# EasyEDA Pro project b6s.eprj, schematic Schematic1
Board Name: Board1; Create Date: 2024-09-07
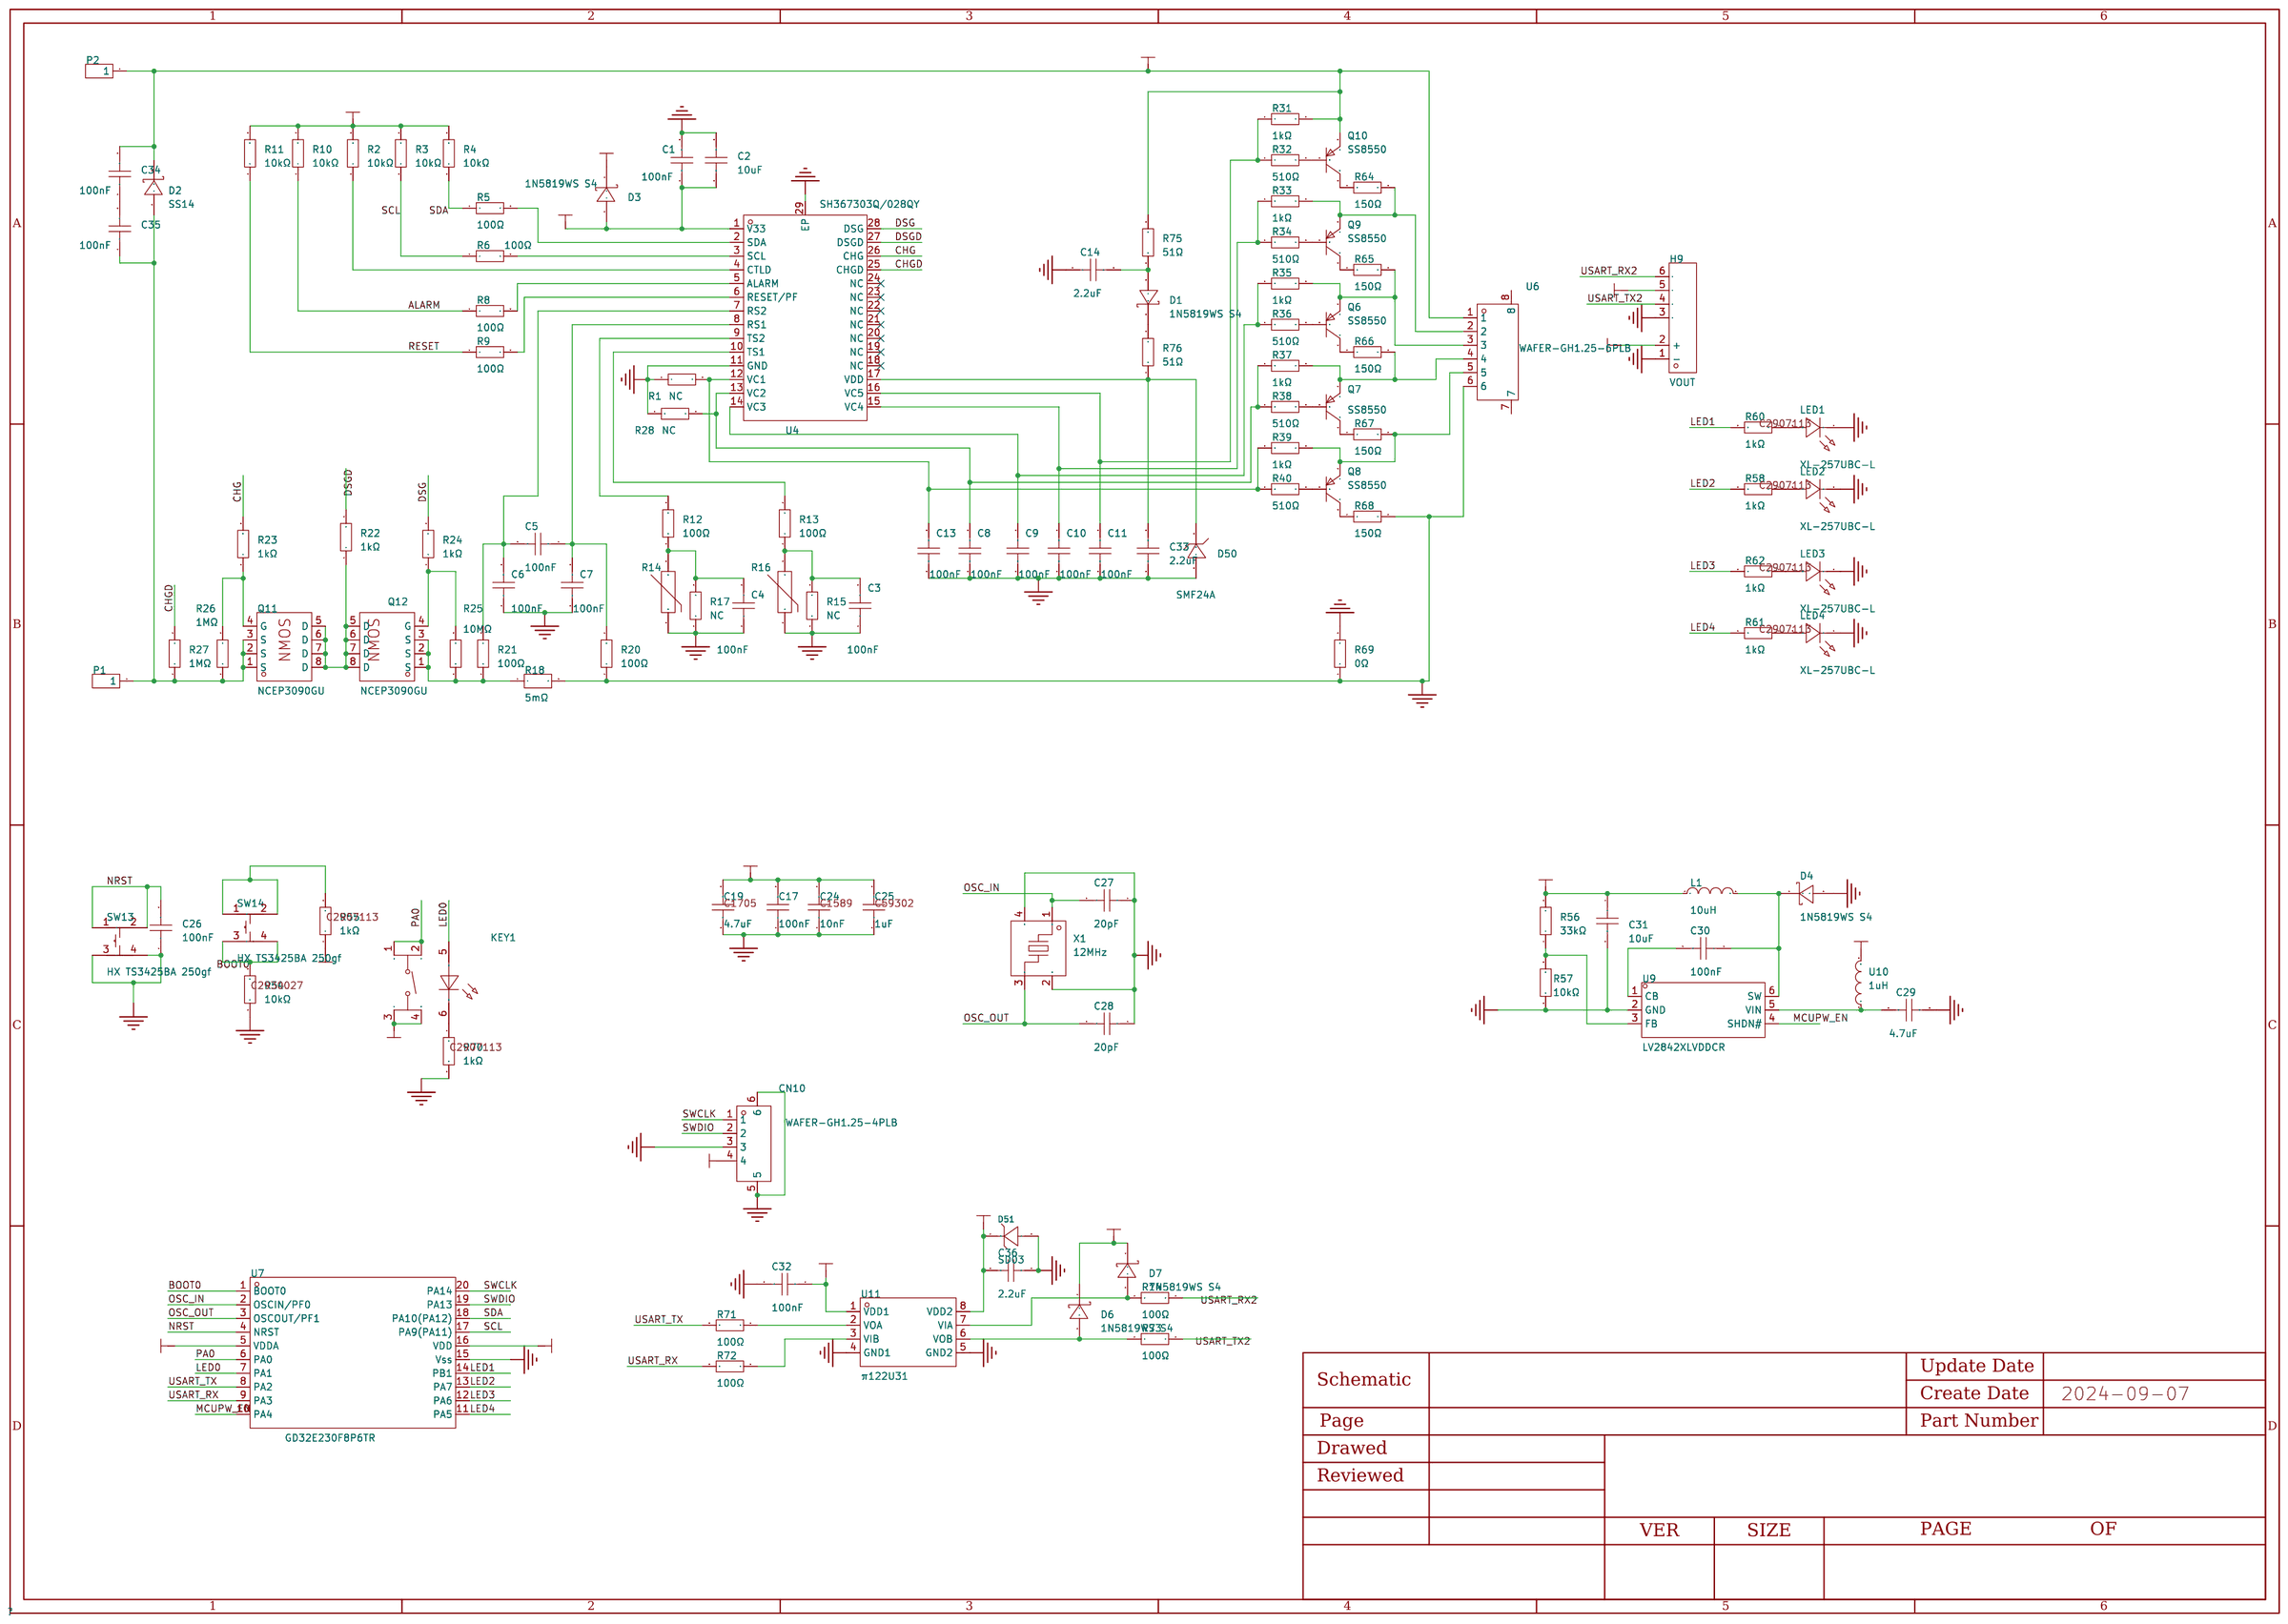
[diagram p0: schematic sheet]

## Parts
C1  100nF  [C0603]
C2  10uF  [C0603]
C3  100nF  [C0603]
C4  100nF  [C0603]
C5  100nF  [C0603]
C6  100nF  [C0603]
C7  100nF  [C0603]
C8  100nF  [C0603]
C9  100nF  [C0603]
C10  100nF  [C0603]
C11  100nF  [C0603]
C13  100nF  [C0603]
C14  2.2uF  [C0805]
C17  100nF  [C0603]
C19  4.7uF  [C0603]
C24  10nF  [C0603]
C25  1uF  [C0603]
C26  100nF  [C0603]
C27  20pF  [C0603]
C28  20pF  [C0603]
C29  4.7uF  [C0805]
C30  100nF  [C0603]
C31  10uF  [C0603]
C32  100nF  [C0603]
C33  2.2uF  [C0805]
C34  100nF  [C0603]
C35  100nF  [C0603]
C36  2.2uF  [C0603]
CN10  WAFER-GH1.25-4PLB  [CONN-SMD_4P-P1.25_XUNPU_WAFER-GH1.25-4PLB]
D1  1N5819WS S4  [SOD-323_L1.6-W1.3-LS2.7-RD]
D2  SS14  [SMA_L4.2-W2.6-LS5.3-RD]
D3  1N5819WS S4  [SOD-323_L1.6-W1.3-LS2.7-RD]
D4  1N5819WS S4  [SOD-323_L1.6-W1.3-LS2.7-RD]
D6  1N5819WS S4  [SOD-323_L1.6-W1.3-LS2.7-RD]
D7  1N5819WS S4  [SOD-323_L1.6-W1.3-LS2.7-RD]
D50  SMF24A  [SOD-123FL_L2.7-W1.8-LS3.8-RD]
D51  SD03  [SOD-323_L1.8-W1.3-LS2.5-RD]
H9  VOUT  [AMSS_XT60_2+4]
KEY1  -  [LED_BUTTON]
L1  10uH  [L1206]
LED1  XL-257UBC-L  [LED-TH_L5.0-W2.5-P2.54-FD_GREEN_XL-257SYGD-L]
LED2  XL-257UBC-L  [LED-TH_L5.0-W2.5-P2.54-FD_GREEN_XL-257SYGD-L]
LED3  XL-257UBC-L  [LED-TH_L5.0-W2.5-P2.54-FD_GREEN_XL-257SYGD-L]
LED4  XL-257UBC-L  [LED-TH_L5.0-W2.5-P2.54-FD_GREEN_XL-257SYGD-L]
P1  -  [Wire_14AWG]
P2  -  [Wire_14AWG]
Q6  SS8550  [SOT-23-3_L2.9-W1.3-P1.90-LS2.4-BR]
Q7  SS8550  [SOT-23-3_L2.9-W1.3-P1.90-LS2.4-BR]
Q8  SS8550  [SOT-23-3_L2.9-W1.3-P1.90-LS2.4-BR]
Q9  SS8550  [SOT-23-3_L2.9-W1.3-P1.90-LS2.4-BR]
Q10  SS8550  [SOT-23-3_L2.9-W1.3-P1.90-LS2.4-BR]
Q11  NCEP3090GU  [DFN-8_L5.8-W4.9-P1.27-LS6.1-BL-2]
Q12  NCEP3090GU  [DFN-8_L5.8-W4.9-P1.27-LS6.1-BL-2]
R1  NC  [R0603]
R2  10kΩ  [R0603]
R3  10kΩ  [R0603]
R4  10kΩ  [R0603]
R5  100Ω  [R0603]
R6  100Ω  [R0603]
R8  100Ω  [R0603]
R9  100Ω  [R0603]
R10  10kΩ  [R0603]
R11  10kΩ  [R0603]
R12  100Ω  [R0603]
R13  100Ω  [R0603]
R14  MF52A103F3950 (A1)  [RES-TH_L2.5-W2.5-P1.70-D0.3]
R15  NC  [R0603]
R16  MF52A103F3950 (A1)  [RES-TH_L2.5-W2.5-P1.70-D0.3]
R17  NC  [R0603]
R18  5mΩ  [R1206]
R20  100Ω  [R0603]
R21  100Ω  [R0603]
R22  1kΩ  [R0603]
R23  1kΩ  [R0603]
R24  1kΩ  [R0603]
R25  10MΩ  [R0603]
R26  1MΩ  [R0603]
R27  1MΩ  [R0603]
R28  NC  [R0603]
R31  1kΩ  [R0603]
R32  510Ω  [R0603]
R33  1kΩ  [R0603]
R34  510Ω  [R0603]
R35  1kΩ  [R0603]
R36  510Ω  [R0603]
R37  1kΩ  [R0603]
R38  510Ω  [R0603]
R39  1kΩ  [R0603]
R40  510Ω  [R0603]
R54  10kΩ  [R0603]
R55  1kΩ  [R0603]
R56  33kΩ  [R0603]
R57  10kΩ  [R0603]
R58  1kΩ  [R0603]
R60  1kΩ  [R0603]
R61  1kΩ  [R0603]
R62  1kΩ  [R0603]
R64  150Ω  [R1206]
R65  150Ω  [R1206]
R66  150Ω  [R1206]
R67  150Ω  [R1206]
R68  150Ω  [R1206]
R69  0Ω  [R0603]
R70  1kΩ  [R0603]
R71  100Ω  [R0603]
R72  100Ω  [R0603]
R73  100Ω  [R0603]
R74  100Ω  [R0603]
R75  51Ω  [R0805]
R76  51Ω  [R0805]
SW13  HX TS3425BA 250gf  [SW-SMD_4P-L4.2-W3.2-P2.15-LS4.6-1]
SW14  HX TS3425BA 250gf  [SW-SMD_4P-L4.2-W3.2-P2.15-LS4.6-1]
U4  SH367303Q/028QY  [QFN-28_L5.0-W5.0-P0.50-TL-EP3.3]
U6  WAFER-GH1.25-6PLB  [CONN-SMD_6P-P1.25_XUNPU_WAFER-GH1.25-6PLB]
U7  GD32E230F8P6TR  [TSSOP-20_L6.5-W4.4-P0.65-LS6.4-BL]
U9  LV2842XLVDDCR  [SOT-23-6_L2.9-W1.6-P0.95-LS2.8-BR]
U10  1uH  [L0603]
U11  π122U31  [SOIC-8_L4.9-W3.9-P1.27-LS6.0-BL]
X1  12MHz  [OSC-SMD_4P-L3.2-W2.5-BL]

## Library data of the parts
C1 C3-C11 C13 C17 C26 C32 C34 C35 = CC0603KRX7R9BB104: LCSC Part Name: 100nF ±10% 50V; Supplier Part: C14663; Manufacturer: YAGEO(国巨); Supplier Footprint: 0603; JLCPCB Part Class: Basic Part; Datasheet: https://atta.szlcsc.com/upload/public/pdf/source/20180910/C282072_33301C7F631E79921B82A8DAC6BCC5B3.pdf; Supplier: LCSC; Tolerance: ±10%; Voltage Rated: 50V; Temperature Coefficient: X7R
C2 = CL10A106MP8NNNC: LCSC Part Name: 10uF ±20% 10V; Supplier Part: C85713; Manufacturer: SAMSUNG(三星); Supplier Footprint: 0603; JLCPCB Part Class: Extended Part; Datasheet: https://atta.szlcsc.com/upload/public/pdf/source/20160218/1457707763339.pdf; Supplier: LCSC; Tolerance: ±20%; Voltage Rated: 10V; Temperature Coefficient: X5R
C14 C33 = CL21A225KBQNNNE: LCSC Part Name: 2.2uF ±10% 50V; Supplier Part: C377773; Manufacturer: SAMSUNG(三星); Supplier Footprint: 0805; JLCPCB Part Class: Basic Part; Datasheet: https://atta.szlcsc.com/upload/public/pdf/source/20160218/1457707763339.pdf; Supplier: LCSC; Tolerance: ±10%; Voltage Rated: 50V; Temperature Coefficient: X5R
C19 = CL10A475KP8NNNC: LCSC Part Name: 4.7uF ±10% 10V; Supplier Part: C1705; Manufacturer: SAMSUNG(三星); Supplier Footprint: 0603; JLCPCB Part Class: Extended Part; Datasheet: https://atta.szlcsc.com/upload/public/pdf/source/20160218/1457707763339.pdf; Supplier: LCSC; Tolerance: ±10%; Voltage Rated: 10V; Temperature Coefficient: X5R; Check: true
C24 = CL10B103KB8NNNC: LCSC Part Name: 10nF ±10% 50V; Supplier Part: C1589; Manufacturer: SAMSUNG(三星); Supplier Footprint: 0603; JLCPCB Part Class: Extended Part; Datasheet: https://atta.szlcsc.com/upload/public/pdf/source/20160218/1457707763339.pdf; Supplier: LCSC; Tolerance: ±10%; Voltage Rated: 50V; Temperature Coefficient: X7R; Check: true
C25 = 0603B105K250NT: LCSC Part Name: 1uF ±10% 25V; Supplier Part: C59302; Manufacturer: FH(风华); Supplier Footprint: 0603; JLCPCB Part Class: Extended Part; Datasheet: https://atta.szlcsc.com/upload/public/pdf/source/20200305/C486355_26A10D38EF8C2A5C37091D0039909270.pdf; Supplier: LCSC; Tolerance: ±10%; Voltage Rated: 25V; Temperature Coefficient: X7R
C27 C28 = 0603CG200J500NT: LCSC Part Name: 20pF ±5% 50V; Supplier Part: C91702; Manufacturer: FH(风华); Supplier Footprint: 0603; JLCPCB Part Class: Extended Part; Datasheet: https://atta.szlcsc.com/upload/public/pdf/source/20200305/C486355_26A10D38EF8C2A5C37091D0039909270.pdf; Supplier: LCSC; Tolerance: ±5%; Voltage Rated: 50V; Temperature Coefficient: C0G; Type: 厚膜电阻; Power(Watts): 100mW; Overload Voltage (Max): 75V; Operating Temperature Range: -55℃~+155℃
C29 = CGA0805X7R475K350MT: LCSC Part Name: 4.7uF ±10% 35V; Supplier Part: C6119943; Manufacturer: HRE(芯声); Supplier Footprint: 0805; JLCPCB Part Class: Extended Part; Datasheet: https://atta.szlcsc.com/upload/public/pdf/source/20160218/1457707763339.pdf; Supplier: LCSC; Tolerance: ±10%; Voltage Rated: 35V; Temperature Coefficient: X7R
C30 = CC0603KRX7R9BB104: LCSC Part Name: 100nF ±10% 50V; Supplier Part: C14663; Manufacturer: YAGEO(国巨); Supplier Footprint: 0603; JLCPCB Part Class: Basic Part; Datasheet: https://atta.szlcsc.com/upload/public/pdf/source/20180910/C282072_33301C7F631E79921B82A8DAC6BCC5B3.pdf; Supplier: LCSC; Tolerance: ±10%; Voltage Rated: 50V; Temperature Coefficient: X7R; Type: 厚膜电阻; Power(Watts): 100mW; Overload Voltage (Max): 75V; Operating Temperature Range: -55℃~+155℃
C31 = CL10A106MP8NNNC: LCSC Part Name: 10uF ±20% 10V; Supplier Part: C85713; Manufacturer: SAMSUNG(三星); Supplier Footprint: 0603; JLCPCB Part Class: Extended Part; Datasheet: https://atta.szlcsc.com/upload/public/pdf/source/20160218/1457707763339.pdf; Supplier: LCSC; Tolerance: ±20%; Voltage Rated: 10V; Temperature Coefficient: X5R; Type: 厚膜电阻; Power(Watts): 100mW; Overload Voltage (Max): 75V; Operating Temperature Range: -55℃~+155℃
C36 = CL10A225KP8NNNC: LCSC Part Name: 2.2uF ±10% 10V; Supplier Part: C1607; Manufacturer: SAMSUNG(三星); Supplier Footprint: 0603; JLCPCB Part Class: Extended Part; Datasheet: https://atta.szlcsc.com/upload/public/pdf/source/20160218/1457707763339.pdf; Supplier: LCSC; Tolerance: ±10%; Voltage Rated: 10V; Temperature Coefficient: X5R
CN10 = WAFER-GH1.25-4PLB: LCSC Part Name: 1x4P 间距:1.25mm 立贴 系列:GH; Supplier Part: C3029370; Manufacturer: XUNPU(讯普); Supplier Footprint: SMD,P=1.25mm; JLCPCB Part Class: Extended Part; Datasheet: https://atta.szlcsc.com/upload/public/pdf/source/20220527/44F824AAC8C2B617205E15955FF9C23D.pdf; Supplier: LCSC; Pins Structure: 1x4P; Pitch: 1.25mm; Mounting Style: 立贴; Reference Series: GH; Number of Pins: 4P; Number of Rows: 1; Number of PINs Per Row: 4; Current Rating (Max): 1A; Operating Temperature Range: -25℃~+85℃
D1 D3 D4 D6 D7 = 1N5819WS S4_C2927280: LCSC Part Name: 电压:40V 电流:350mA; Supplier Part: C2927280; Manufacturer: JSMSEMI(杰盛微); Supplier Footprint: SOD-323; JLCPCB Part Class: Extended Part; Datasheet: https://atta.szlcsc.com/upload/public/pdf/source/20240105/574E572B69D2DF1CD36E5C05FAB269C4.pdf; Supplier: LCSC; Diode Configuration: 独立式; Forward Voltage (Vf@If): 600mV@200mA; Reverse Voltage (Vr): 40V; Average Rectified Current (Io): 350mA; Reverse Leakage Current (Ir): 5uA@30V
D2 = SS14_C2480: LCSC Part Name: 电压:40V 电流:1A; Supplier Part: C2480; Manufacturer: MDD(辰达半导体); Supplier Footprint: SMA(DO-214AC); JLCPCB Part Class: 基础库; Datasheet: https://atta.szlcsc.com/upload/public/pdf/source/20230712/2DB6064CFBB99DE6DB116BEE8208BE66.pdf; Supplier: LCSC; Diode Configuration: 独立式; Forward Voltage (Vf@If): 550mV@1A; Reverse Voltage (Vr): 40V; Rectified Current: 1A; Reverse Leakage Current (Ir): 300uA@40V
D50 = SMF24A_C726910: Supplier Part: C726910; Manufacturer: TWGMC(台湾迪嘉); Supplier Footprint: SOD-123FL; JLCPCB Part Class: Extended Part; Datasheet: https://atta.szlcsc.com/upload/public/pdf/source/20200825/C726891_B615A55314C94A3B16B7FBCD32D40567.pdf; Supplier: LCSC; Reverse Stand-Off Voltage (Vrwm): 22V; Maximum Clamping Voltage: 35.5V; Peak Pulse Current (Ipp)@10/1000us: 5.6A; Breakdown Voltage: 24.4V; Reverse Leakage Current (Ir): 1uA; Type: TVS
D51 = SD03: LCSC Part Name: 单向TVS 3.3V截止 20A峰值脉冲; Supplier Part: C502526; Manufacturer: MDD; Supplier Footprint: SOD-323; JLCPCB Part Class: 扩展库; Datasheet: https://atta.szlcsc.com/upload/public/pdf/source/20230823/A4FB82CF4063F527BA646C80DC150D6A.pdf; Supplier: LCSC; Reverse Stand-Off Voltage (Vrwm): 3.3V; Maximum Clamping Voltage: 14V; Peak Pulse Current (Ipp)@10/1000us: 20A; Breakdown Voltage: 4V; Type: TVS
H9 = AMSS_XT60_2+4_fml: Check: false
KEY1 = LED_BUTTON: Check: false
L1 = CMI321609X100KT: LCSC Part Name: 10uH ±10%; Supplier Part: C1051; Manufacturer: FH(风华); Supplier Footprint: 1206; JLCPCB Part Class: Extended Part; Datasheet: https://atta.szlcsc.com/upload/public/pdf/source/20230223/88BF0F64804B4350E07D929F36C73B7F.pdf; Supplier: LCSC; Tolerance: ±10%; Rated Current: 25mA; DC Resistance (DCR): 800mΩ; Q @ Freq: 35@2MHz; Frequency - Self Resonant: 24MHz
LED1-LED4 = XL-257UBC-L: Supplier Part: C5440566; Manufacturer: XINGLIGHT(成兴光); Supplier Footprint: 插件,L=5mm; JLCPCB Part Class: 扩展库; Datasheet: https://atta.szlcsc.com/upload/public/pdf/source/20240218/40D0102E80711B0D8E9DC8314F36558B.pdf; Supplier: LCSC; Lamp Holder Type: 2*5*7mm方形灯头; Emitted Color: 蓝色; Forward Voltage (VF): 3V~3.4V; Power Dissipation: 80mW; Forward Current: 20mA; Dominant Wavelength: 465nm~470nm; Peak Wavelength: 468nm; Lens Color: 无色透明透镜; Luminous Intensity: 2000mcd; Viewing Angle: 35°; Operating Temperature: -25℃~+85℃
P1 P2 = Wire_14AWG: Check: false
Q6-Q10 = SS8550_C7420371: LCSC Part Name: 耐压:25V 电流:1.5A PNP H档 200-350; Supplier Part: C7420371; Manufacturer: 宏迦橙; Supplier Footprint: SOT-23; JLCPCB Part Class: Extended Part; Datasheet: https://atta.szlcsc.com/upload/public/pdf/source/20231222/5BDA6DBF3A79C59009F81F0EEE6F8969.pdf; Supplier: LCSC; Transistor Type: PNP; Collector Current (Ic): 1.5A; Collector-Emitter Breakdown Voltage (Vceo): 25V; Power Dissipation (Pd): 300mW; DC Current Gain (hFE@Ic,Vce): 120@100mA,1.0V; Transition Frequency (fT): 100MHz; Collector Cut-Off Current (Icbo): 100nA; Collector-Emitter Saturation Voltage (VCE(sat)@Ic,Ib): 500mV@800mA,80mA; Operating Temperature: -55℃~+150℃
Q11 Q12 = NCEP3090GU: LCSC Part Name: 1个N沟道 耐压:30V 电流:90A; Supplier Part: C502967; Manufacturer: NCE(无锡新洁能); Supplier Footprint: DFN-8(4.9x5.8); JLCPCB Part Class: Extended Part; Datasheet: https://atta.szlcsc.com/upload/public/pdf/source/20201202/C502967_1009EB0823F10C8B4E6881BA39DB5D87.pdf; Supplier: LCSC; Type: 1个N沟道; Drain Source Voltage (Vdss): 30V; Continuous Drain Current (Id): 90A; Power Dissipation (Pd): 70W; Drain Source On Resistance (RDS(on)@Vgs,Id): 2mΩ@10V,20A; Gate Threshold Voltage (Vgs(th)@Id): 1.5V@250uA; Total Gate Charge (Qg@Vgs): 34.8nC@10V; Input Capacitance (Ciss@Vds): 2.1nF@15V; Reverse Transfer Capacitance (Crss@Vds): 15.5pF@15V; Operating Temperature: -55℃~+150℃@(Tj)
R1 R15 R17 R28 = Res_0603: Supplier Footprint: 0603; Check: false
R2-R4 R10 R11 R54 = FRC0603J103TS: LCSC Part Name: 10kΩ ±5% 100mW 厚膜电阻; Supplier Part: C2930027; Manufacturer: FOJAN(富捷); Supplier Footprint: 0603; JLCPCB Part Class: Extended Part; Datasheet: https://atta.szlcsc.com/upload/public/pdf/source/20211221/925EC7D7225764EE0046F22065062C87.pdf; Supplier: LCSC; Type: 厚膜电阻; Tolerance: ±5%; Power(Watts): 100mW; Overload Voltage (Max): 75V; Temperature Coefficient: ±100ppm/℃; Operating Temperature Range: -55℃~+155℃
R5 R6 R8 R9 R12 R13 R20 R21 R71-R74 = RC0603FR-07100RL: LCSC Part Name: 厚膜电阻 100Ω ±1% 100mW; Supplier Part: C105588; Manufacturer: YAGEO(国巨); Supplier Footprint: 0603; JLCPCB Part Class: Extended Part; Datasheet: https://atta.szlcsc.com/upload/public/pdf/source/20180316/70C0E2BDAE7FCC62C531A5A58D202EE1.pdf; Supplier: LCSC; Type: 厚膜电阻; Tolerance: ±1%; Power(Watts): 100mW; Overload Voltage (Max): 75V; Temperature Coefficient: ±100ppm/℃; Operating Temperature Range: -55℃~+155℃
R14 R16 = MF52A103F3950 (A1): LCSC Part Name: 10kΩ 电阻精度:±1% 3950K; Supplier Part: C13879; Manufacturer: 时恒; Supplier Footprint: 插件,P=1.7mm; JLCPCB Part Class: 扩展库; Datasheet: https://atta.szlcsc.com/upload/public/pdf/source/20181018/C324070_6015F64EA824A635FDB9BBFA1E1FD5FE.pdf; Supplier: LCSC; Resistance @ 25℃: 10kΩ; B Constant (25℃/50℃): 3950K; Resistance Tolerance: ±1%; Power: 50mW; B Constant Tolerance: ±1%; Operating Temperature: -55℃~+125℃
R18 = HoLLR1206-1W-5mR-1%: LCSC Part Name: 5mΩ ±1% 1W; Supplier Part: C2988648; Manufacturer: Milliohm(毫欧); Supplier Footprint: 1206; JLCPCB Part Class: Extended Part; Datasheet: https://atta.szlcsc.com/upload/public/pdf/source/20220407/F189C92CC2C10DCB4BF36375122B9E11.pdf; Supplier: LCSC; Type: 采样电阻; Tolerance: ±1%; Power(Watts): 1W; Rated Current: 31.6A; Temperature Coefficient: ±50ppm/℃; Mounting Sytle: 贴片
R22-R24 R31 R33 R35 R37 R39 R55 R58 R60-R62 R70 = FRC0603J102 TS: LCSC Part Name: 1kΩ ±5% 100mW 厚膜电阻; Supplier Part: C2907113; Manufacturer: FOJAN(富捷); Supplier Footprint: 0603; JLCPCB Part Class: Extended Part; Datasheet: https://atta.szlcsc.com/upload/public/pdf/source/20211221/925EC7D7225764EE0046F22065062C87.pdf; Supplier: LCSC; Type: 厚膜电阻; Tolerance: ±5%; Power(Watts): 100mW; Overload Voltage (Max): 75V; Temperature Coefficient: ±100ppm/℃; Operating Temperature Range: -55℃~+155℃
R25 = 0603WAJ0106T5E: LCSC Part Name: 10MΩ ±5% 100mW 厚膜电阻; Supplier Part: C26097; Manufacturer: UNI-ROYAL(厚声); Supplier Footprint: 0603; JLCPCB Part Class: Extended Part; Datasheet: https://atta.szlcsc.com/upload/public/pdf/source/20200306/C422600_1E6D84923E4A46A82E41ADD87F860B5C.pdf; Supplier: LCSC; Type: 厚膜电阻; Tolerance: ±5%; Power(Watts): 100mW; Overload Voltage (Max): 75V; Temperature Coefficient: ±100ppm/℃; Operating Temperature Range: -55℃~+155℃
R26 R27 = 0603WAJ0105T5E: LCSC Part Name: 1MΩ ±5% 100mW 厚膜电阻; Supplier Part: C26098; Manufacturer: UNI-ROYAL(厚声); Supplier Footprint: 0603; JLCPCB Part Class: Extended Part; Datasheet: https://atta.szlcsc.com/upload/public/pdf/source/20200306/C422600_1E6D84923E4A46A82E41ADD87F860B5C.pdf; Supplier: LCSC; Type: 厚膜电阻; Tolerance: ±5%; Power(Watts): 100mW; Overload Voltage (Max): 75V; Temperature Coefficient: ±100ppm/℃; Operating Temperature Range: -55℃~+155℃
R32 R34 R36 R38 R40 = FRC0603J511 TS: LCSC Part Name: 510Ω ±5% 100mW 厚膜电阻; Supplier Part: C2907179; Manufacturer: FOJAN(富捷); Supplier Footprint: 0603; JLCPCB Part Class: Extended Part; Datasheet: https://atta.szlcsc.com/upload/public/pdf/source/20211221/925EC7D7225764EE0046F22065062C87.pdf; Supplier: LCSC; Type: 厚膜电阻; Tolerance: ±5%; Power(Watts): 100mW; Overload Voltage (Max): 75V; Temperature Coefficient: ±100ppm/℃; Operating Temperature Range: -55℃~+155℃
R56 = 0603WAF3302T5E: LCSC Part Name: 33kΩ ±1% 100mW 厚膜电阻; Supplier Part: C4216; Manufacturer: UNI-ROYAL(厚声); Supplier Footprint: 0603; JLCPCB Part Class: Basic Part; Datasheet: https://atta.szlcsc.com/upload/public/pdf/source/20200306/C422600_1E6D84923E4A46A82E41ADD87F860B5C.pdf; Supplier: LCSC; Type: 厚膜电阻; Tolerance: ±1%; Power(Watts): 100mW; Overload Voltage (Max): 75V; Temperature Coefficient: ±100ppm/℃; Operating Temperature Range: -55℃~+155℃
R57 = RC0603FR-0710KL: LCSC Part Name: 厚膜电阻 10kΩ ±1% 100mW; Supplier Part: C98220; Manufacturer: YAGEO(国巨); Supplier Footprint: 0603; JLCPCB Part Class: Extended Part; Datasheet: https://atta.szlcsc.com/upload/public/pdf/source/20180927/C295883_E8D83085EA81BD7DE0B2B681138C15EE.pdf; Supplier: LCSC; Type: 厚膜电阻; Tolerance: ±1%; Power(Watts): 100mW; Overload Voltage (Max): 75V; Temperature Coefficient: ±100ppm/℃; Operating Temperature Range: -55℃~+155℃
R64-R68 = FRC1206J151 TS: LCSC Part Name: 150Ω ±5% 250mW 厚膜电阻; Supplier Part: C2907432; Manufacturer: FOJAN(富捷); Supplier Footprint: 1206; JLCPCB Part Class: Extended Part; Datasheet: https://atta.szlcsc.com/upload/public/pdf/source/20211221/925EC7D7225764EE0046F22065062C87.pdf; Supplier: LCSC; Type: 厚膜电阻; Tolerance: ±5%; Power(Watts): 250mW; Overload Voltage (Max): 200V; Temperature Coefficient: ±100ppm/℃; Operating Temperature Range: -55℃~+155℃
R69 = 0603WAF0000T5E: LCSC Part Name: 0Ω ±1% 100mW 厚膜电阻; Supplier Part: C21189; Manufacturer: UNI-ROYAL(厚声); Supplier Footprint: 0603; JLCPCB Part Class: Basic Part; Datasheet: https://atta.szlcsc.com/upload/public/pdf/source/20200306/C422600_1E6D84923E4A46A82E41ADD87F860B5C.pdf; Supplier: LCSC; Type: 厚膜电阻; Tolerance: ±1%; Power(Watts): 100mW; Overload Voltage (Max): 75V; Operating Temperature Range: -55℃~+155℃
R75 R76 = 0805W8F510JT5E: LCSC Part Name: 51Ω ±1% 125mW 厚膜电阻; Supplier Part: C17738; Manufacturer: UNI-ROYAL(厚声); Supplier Footprint: 0805; JLCPCB Part Class: 基础库; Datasheet: https://atta.szlcsc.com/upload/public/pdf/source/20200306/C422600_1E6D84923E4A46A82E41ADD87F860B5C.pdf; Supplier: LCSC; Type: 厚膜电阻; Tolerance: ±1%; Power(Watts): 125mW; Overload Voltage (Max): 150V; Temperature Coefficient: ±100ppm/℃; Operating Temperature Range: -55℃~+155℃
SW13 SW14 = HX TS3425BA 250gf: LCSC Part Name: 4.2*3.4*2.5mm 立贴 轻触开关; Supplier Part: C5143626; Manufacturer: hanxia(韩下); Supplier Footprint: SMD; JLCPCB Part Class: Extended Part; Datasheet: https://atta.szlcsc.com/upload/public/pdf/source/20220824/1A14C87ED744C5EEF64F014B8B111430.pdf; Supplier: LCSC; Circuit: 单刀单掷; Operating Force: 250gf; Mounting Style: 立贴; Switch Length: 4.2mm; Switch Width: 3.4mm; Switch Height: 2.5mm; Contact Current: 50mA; Voltage Rating (DC): 12V; Insulation Resistance: 100MΩ; Actuator/Cap Color: 白色; With Lamp: 无; Pin Style: SMD接片; Mechanical Life: 10万次; Operating Temperature: -20℃~+85℃; Actuator Style: 椭圆形按钮; Strike Gundam: 不带
U4 = SH367303Q/028QY: Supplier Part: C2839013; Supplier Footprint: QFN-28-EP(5x5); JLCPCB Part Class: 扩展库; Datasheet: https://atta.szlcsc.com/upload/public/pdf/source/20211010/C2839013_F8EB19FBD6B2929B0C20591E4E1EC47D.pdf; Supplier: LCSC
U6 = WAFER-GH1.25-6PLB: LCSC Part Name: 1x6P 间距:1.25mm 立贴 系列:GH; Supplier Part: C3029372; Manufacturer: XUNPU(讯普); Supplier Footprint: SMD,P=1.25mm; JLCPCB Part Class: Extended Part; Datasheet: https://atta.szlcsc.com/upload/public/pdf/source/20220527/44F824AAC8C2B617205E15955FF9C23D.pdf; Supplier: LCSC; Pins Structure: 1x6P; Pitch: 1.25mm; Mounting Style: 立贴; Reference Series: GH; Number of Pins: 6P; Number of Rows: 1; Number of PINs Per Row: 6; Current Rating (Max): 1A; Operating Temperature Range: -25℃~+85℃
U7 = GD32E230F8P6TR: Supplier Part: C380785; Manufacturer: GigaDevice(兆易创新); Supplier Footprint: TSSOP-20; JLCPCB Part Class: Extended Part; Datasheet: https://atta.szlcsc.com/upload/public/pdf/source/20190430/C380785_EA8FF1772306CFBEF123F31B40CBE5B6.pdf; Supplier: LCSC; CPU Core: ARM-M系列; Program Storage Size: 64KB; RAM Size: 8KB; GPIO Ports Number: 15; Operating Voltage Range: 1.8V~3.6V; CPU Maximum Speed: 72MHz; Program Memory Type: FLASH; Operating Temperature Range: -40℃~+85℃; ADC (Bit): 12bit; PWM (Bit): 16bit; 16Bit Timer: 5; UART/USART: 2; I2C: 2; SPI: 2; Internal Comparator: 有; Peripheral/Function: 片载温度传感器；DMA；看门狗；LIN总线协议；PWM；IrDA；RTC实时时钟; Watchdog: 有; Real-Time Clock: 有; Infrared Data Association: 有; Direct Memory Access: 有; Internal Oscillator: 有
U9 = LV2842XLVDDCR: Supplier Part: C225807; Manufacturer: TI(德州仪器); Supplier Footprint: SOT-23-6; JLCPCB Part Class: Extended Part; Datasheet: https://atta.szlcsc.com/upload/public/pdf/source/20180820/C225807_86EBD6310E0F8BF9D1D4E9854A4EDCFD.pdf; Supplier: LCSC; Function: 降压型; Switch tube (built-in/external): 内置
U10 = YL160808-1R0K: LCSC Part Name: 1uH ±10%; Supplier Part: C2839970; Manufacturer: YJYCOIN(益嘉源); Supplier Footprint: 0603; JLCPCB Part Class: Extended Part; Datasheet: https://atta.szlcsc.com/upload/public/pdf/source/20210615/C2839970_ABC794F14AEDE076178322CDBBF81D48.pdf; Supplier: LCSC; Tolerance: ±10%; Rated Current: 25mA; DC Resistance (DCR): 600mΩ; Q @ Freq: 35@10MHz; Frequency - Self Resonant: 75MHz
U11 = π122U31: LCSC Part Name: 增强型ESD 3.0kVrms/6.0kVrms 150Kbps双通道数字隔离器; Supplier Part: C471590; Manufacturer: 2Pai Semi(荣湃); Supplier Footprint: SOIC-8; JLCPCB Part Class: Extended Part; Datasheet: https://atta.szlcsc.com/upload/public/pdf/source/20191223/C471590_0EC0A3D8C50EA147F11BC2F4781C203C.pdf; Supplier: LCSC; Voltage Isolation or Not: 带电压隔离; Supply Voltage: 3V~5.5V; Data Rate: 150Kbps; Number of Channels: 2; Isolation voltage: 3000Vrms; Forward Channel: 0; Reverse channel: 2
X1 = X322512MSB4SI: LCSC Part Name: 12MHz ±10ppm 20pF; Supplier Part: C9002; Manufacturer: YXC(扬兴晶振); Supplier Footprint: SMD3225-4P; JLCPCB Part Class: Basic Part; Datasheet: https://atta.szlcsc.com/upload/public/pdf/source/20240329/19D5F850207469550BEB00D7DFEDBC7A.pdf; Supplier: LCSC; Crystal Type: 贴片晶振; Normal temperature Frequency Tolerance: ±10ppm; External load capacitor: 20pF; Frequency Stability(Full temperature range): ±20ppm; Operating Temperature: -40℃~+85℃; Frequency Tolerance: ±20ppm; Frequency Stability: ±20ppm; Load Capacitance: 20pF

## Nets
GND: C1.2 C2.2 C3.1 C4.1 C6.1 C7.1 C8.1 C9.1 C10.1 C11.1 C13.1 C14.1 C17.1 C19.1 C24.1 C25.1 C26.1 C27.1 C28.1 C29.2 C31.2 C32.2 C33.1 CN10.3 CN10.5 CN10.6 D4.2(A) D50.2(A) LED1.1(K) LED2.1(K) LED3.1(K) LED4.1(K) R1.1 R14.1 R15.1 R16.1 R17.1 R28.1 R54.1 R57.1 R69.2 R70.2 SW13.3 SW13.4 U4.11(GND) U4.29(EP) U7.15(Vss) U9.2(GND) U11.4(GND1) X1.2(GND) X1.4(GND)
SGND: C36.1 D51.2(A) H9.3(+) U11.5(GND2)
VBAT+: C34.2 D2.1(K) H9.2(+) P2.1 Q10.2(E) R31.2 R75.2 U6.1 U10.2
ALARM: R8.1 R10.1
BOOT0: R54.2 SW14.3 SW14.4 U7.1(BOOT0)
CHG: R23.2 U4.26(CHG)
CHGD: R27.2 U4.25(CHGD)
DSG: R24.2 U4.28(DSG)
DSGD: R22.2 U4.27(DSGD)
LED0: KEY1.5(A) U7.7(PA1)
LED1: R60.2 U7.14(PB1)
LED2: R58.2 U7.13(PA7)
LED3: R62.2 U7.12(PA6)
LED4: R61.2 U7.11(PA5)
MCU+3.3V: C17.2 C19.2 C24.2 C25.2 C31.1 C32.1 CN10.4 D3.1(K) KEY1.3(4) KEY1.4(2) L1.1 R55.1 R56.2 U7.5(VDDA) U7.16(VDD) U11.1(VDD1)
MCUPW_EN: U7.10(PA4) U9.4(SHDN#)
NRST: C26.2 SW13.1 SW13.2 U7.4(NRST)
OSC_IN: C27.2 U7.2(OSCIN/PF0) X1.1
OSC_OUT: C28.2 U7.3(OSCOUT/PF1) X1.3
PA0: KEY1.1(3) KEY1.2(1) U7.6(PA0)
POGND: H9.1(-) R18.2 R20.1 R68.2 R69.1 U6.6
RESET: R9.1 R11.1
S+3.3V: C36.2 D6.1(K) D7.1(K) D51.1(C) H9.5(+) U11.8(VDD2)
SCL: R3.1 R6.1 U7.17(PA9(PA11))
SDA: R4.1 R5.1 U7.18(PA10(PA12))
SH_+3.3V: C1.1 C2.1 D3.2(A) R2.2 R3.2 R4.2 R10.2 R11.2 U4.1(V33)
SWCLK: CN10.1 U7.20(PA14)
SWDIO: CN10.2 U7.19(PA13)
USART_RX: R72.2 U7.9(PA3)
USART_RX2: H9.6(+) R74.2
USART_TX: R71.2 U7.8(PA2)
USART_TX2: H9.4(+) R73.2
$1N1320: C13.2 R1.2 R39.1 R40.1 U4.12(VC1)
$1N1728: R5.2 U4.2(SDA)
$1N1734: R6.2 U4.3(SCL)
$1N1741: R2.1 U4.4(CTLD)
$1N1748: R8.2 U4.5(ALARM)
$1N1755: R9.2 U4.6(RESET/PF)
$1N2187: C4.2 R12.1 R14.2 R17.2
$1N2189: C3.2 R13.1 R15.2 R16.2
$1N2279: R13.2 U4.10(TS1)
$1N2284: R12.2 U4.9(TS2)
$1N2390: C9.2 R35.1 R36.1 U4.14(VC3)
$1N2395: C8.2 R28.2 R37.1 R38.1 U4.13(VC2)
$1N2545: C5.1 C7.2 R20.2 U4.8(RS1)
$1N2550: C5.2 C6.2 R21.2 U4.7(RS2)
$1N2582: Q12.1(S) Q12.2(S) Q12.3(S) R18.1 R21.1 R25.1
$1N2939: Q11.4(G) R23.1 R26.2
$1N2941: Q12.4(G) R24.1 R25.2
$1N3087: C10.2 R33.1 R34.1 U4.15(VC4)
$1N3093: C11.2 R31.1 R32.1 U4.16(VC5)
$1N3779: C14.2 D1.2(A) R75.1
$1N3964: Q10.1(B) R32.2
$1N4014: Q9.1(B) R34.2
$1N4065: Q6.1(B) R36.2
$1N4115: Q7.1(B) R38.2
$1N4165: Q8.1(B) R40.2
$1N4198: Q9.2(E) R33.2 R64.2 U6.2
$1N4220: Q6.2(E) R35.2 R65.2 U6.3
$1N4226: Q7.2(E) R37.2 R66.2 U6.4
$1N4232: Q8.2(E) R39.2 R67.2 U6.5
$1N9134: R55.2 SW14.1 SW14.2
$1N9618: C29.1 U9.5(VIN) U10.1
$1N9847: C30.1 D4.1(K) L1.2 U9.6(SW)
$1N9920: C30.2 U9.1(CB)
$1N9975: R56.1 R57.2 U9.3(FB)
$1N15428: Q10.3(C) R64.1
$1N15454: Q9.3(C) R65.1
$1N15480: Q6.3(C) R66.1
$1N15506: Q7.3(C) R67.1
$1N15532: Q8.3(C) R68.1
$1N16008: C34.1 C35.2
$1N16122: C33.2 D50.1(C) R76.1 U4.17(VDD)
$1N16427: Q11.5(D) Q11.6(D) Q11.7(D) Q11.8(D) Q12.5(D) Q12.6(D) Q12.7(D) Q12.8(D) R22.1
$1N16448: C35.1 D2.2(A) P1.1 Q11.1(S) Q11.2(S) Q11.3(S) R26.1 R27.1
$1N16731: KEY1.6(C) R70.1
$1N26616: R71.1 U11.2(VOA)
$1N26644: R72.1 U11.3(VIB)
$1N26707: D7.2(A) R74.1 U11.7(VIA)
$1N26714: D6.2(A) R73.1 U11.6(VOB)
$1N36650: LED2.2(A) R58.1
$1N36652: LED1.2(A) R60.1
$1N36654: LED4.2(A) R61.1
$1N36656: LED3.2(A) R62.1
$1N45494: D1.1(K) R76.2

Not connected (* = marked no-connect by the designer): U4 18(NC)* 19(NC)* 20(NC)* 21(NC)* 22(NC)* 23(NC)* 24(NC)*; U6 7 8
